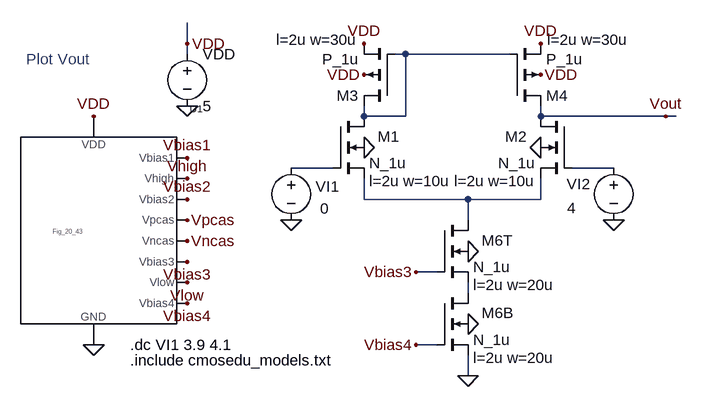
[diagram p0: schematic Fig22_7.asc]
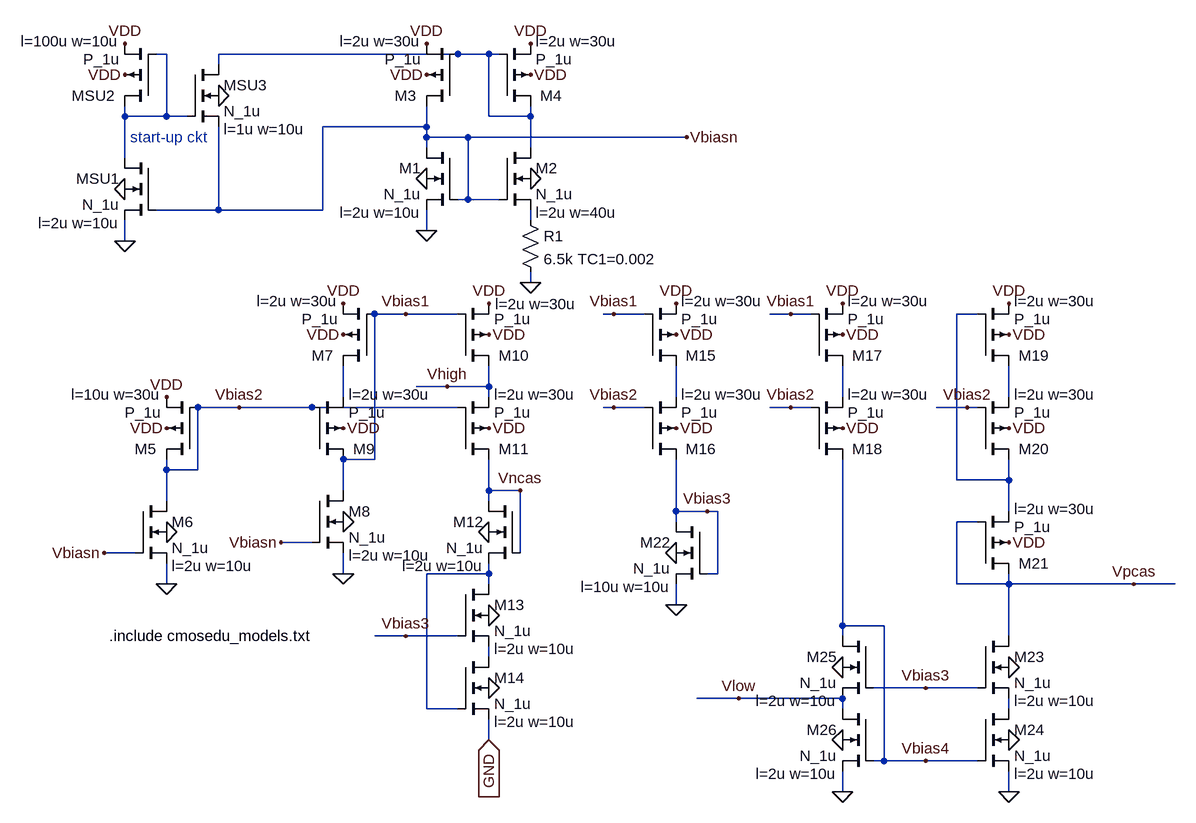
[diagram p1: sub-circuit fig_20_43.asc]
Fig22_7.asc, the LTspice schematic file:
Version 4
SHEET 1 1784 680
WIRE 944 -352 944 -384
WIRE 944 -336 944 -352
WIRE 1280 -336 1264 -336
WIRE 1440 -336 1280 -336
WIRE 1216 -240 1216 -256
WIRE 1280 -240 1280 -336
WIRE 1280 -240 1216 -240
WIRE 1488 -240 1488 -256
WIRE 1680 -240 1488 -240
WIRE 1696 -240 1680 -240
WIRE 1168 -160 1104 -160
WIRE 1600 -160 1536 -160
WIRE 1216 -112 1216 -144
WIRE 1376 -112 1216 -112
WIRE 1488 -112 1488 -144
WIRE 1488 -112 1376 -112
WIRE 1376 -80 1376 -112
WIRE 1328 0 1296 0
WIRE 1376 32 1376 16
WIRE 1328 112 1296 112
WIRE 1376 160 1376 128
FLAG 944 -256 0
FLAG 944 -352 VDD
FLAG 1376 80 0
FLAG 1376 160 0
FLAG 800 -240 VDD
FLAG 800 112 0
FLAG 944 -176 Vbias1
FLAG 944 -144 Vhigh
FLAG 944 -112 Vbias2
FLAG 944 -16 Vbias3
FLAG 944 -80 Vpcas
FLAG 944 -48 Vncas
FLAG 944 48 Vbias4
FLAG 944 16 Vlow
FLAG 1376 -32 0
FLAG 1296 112 Vbias4
FLAG 1296 0 Vbias3
FLAG 1216 -192 0
FLAG 1488 -192 0
FLAG 1104 -80 0
FLAG 1600 -80 0
FLAG 1488 -352 VDD
FLAG 1488 -304 VDD
FLAG 1216 -352 VDD
FLAG 1216 -304 VDD
FLAG 1680 -240 Vout
SYMBOL voltage 944 -352 R0
WINDOW 123 0 0 Left 2
WINDOW 39 0 0 Left 2
SYMATTR InstName VDD
SYMATTR Value 5
SYMBOL nmos4 1328 32 R0
WINDOW 123 56 100 Left 2
WINDOW 0 69 31 Left 2
SYMATTR Value2 l=2u w=20u
SYMATTR InstName M6B
SYMATTR Value N_1u
SYMBOL Fig_20_43 800 -64 R0
SYMATTR InstName U1
SYMBOL nmos4 1328 -80 R0
WINDOW 123 56 100 Left 2
WINDOW 0 69 31 Left 2
SYMATTR Value2 l=2u w=20u
SYMATTR InstName M6T
SYMATTR Value N_1u
SYMBOL nmos4 1168 -240 R0
WINDOW 123 56 100 Left 2
WINDOW 0 69 31 Left 2
SYMATTR Value2 l=2u w=10u
SYMATTR InstName M1
SYMATTR Value N_1u
SYMBOL nmos4 1536 -240 M0
WINDOW 123 56 100 Left 2
WINDOW 0 69 31 Left 2
SYMATTR Value2 l=2u w=10u
SYMATTR InstName M2
SYMATTR Value N_1u
SYMBOL voltage 1600 -176 R0
WINDOW 0 -72 40 Left 2
WINDOW 3 -71 77 Left 2
SYMATTR InstName VI2
SYMATTR Value 4
SYMBOL voltage 1104 -176 R0
WINDOW 0 38 44 Left 2
WINDOW 3 45 78 Left 2
SYMATTR InstName VI1
SYMATTR Value 0
SYMBOL pmos4 1440 -256 M180
WINDOW 123 58 102 Left 2
WINDOW 0 56 16 Left 2
SYMATTR Value2 l=2u w=30u
SYMATTR InstName M4
SYMATTR Value P_1u
SYMBOL pmos4 1264 -256 R180
WINDOW 123 58 102 Left 2
WINDOW 0 56 16 Left 2
SYMATTR Value2 l=2u w=30u
SYMATTR InstName M3
SYMATTR Value P_1u
TEXT 856 136 Left 2 !.include cmosedu_models.txt
TEXT 696 -328 Left 2 ;Plot Vout
TEXT 856 112 Left 2 !.dc VI1 3.9 4.1

fig_20_43.asc, the sub-circuit schematic file:
Version 4
SHEET 1 2164 1112
WIRE 608 -80 592 -80
WIRE 1056 -80 688 -80
WIRE 1104 -80 1056 -80
WIRE 1120 -80 1104 -80
WIRE 688 -64 688 -80
WIRE 544 16 544 0
WIRE 608 16 608 -80
WIRE 608 16 544 16
WIRE 640 16 608 16
WIRE 1104 16 1104 -80
WIRE 1168 16 1168 0
WIRE 1168 16 1104 16
WIRE 1008 32 1008 0
WIRE 1008 32 848 32
WIRE 1008 48 1008 32
WIRE 1072 48 1008 48
WIRE 1408 48 1072 48
WIRE 1008 64 1008 48
WIRE 1168 64 1168 16
WIRE 544 80 544 16
WIRE 1072 144 1072 48
WIRE 1072 144 1056 144
WIRE 1120 144 1072 144
WIRE 688 160 688 32
WIRE 688 160 592 160
WIRE 848 160 848 32
WIRE 848 160 688 160
WIRE 1168 176 1168 160
WIRE 1008 192 1008 160
WIRE 544 208 544 176
WIRE 1168 272 1168 256
WIRE 976 320 928 320
WIRE 1056 320 976 320
WIRE 1296 320 1280 320
WIRE 1344 320 1296 320
WIRE 1568 320 1536 320
WIRE 1600 320 1568 320
WIRE 1856 320 1824 320
WIRE 1040 432 992 432
WIRE 1104 432 1104 400
WIRE 1104 432 1040 432
WIRE 880 448 880 400
WIRE 1104 448 1104 432
WIRE 1392 448 1392 400
WIRE 1648 448 1648 400
WIRE 1904 448 1904 400
WIRE 720 464 656 464
WIRE 832 464 720 464
WIRE 1056 464 832 464
WIRE 1296 464 1280 464
WIRE 1344 464 1296 464
WIRE 1568 464 1536 464
WIRE 1600 464 1568 464
WIRE 1840 464 1792 464
WIRE 1856 464 1840 464
WIRE 928 544 928 320
WIRE 928 544 880 544
WIRE 608 560 608 544
WIRE 656 560 656 464
WIRE 656 560 608 560
WIRE 1824 576 1824 320
WIRE 1904 576 1904 544
WIRE 1904 576 1824 576
WIRE 880 592 880 544
WIRE 1104 592 1104 544
WIRE 1152 592 1104 592
WIRE 608 608 608 560
WIRE 1104 608 1104 592
WIRE 1392 624 1392 544
WIRE 1440 624 1392 624
WIRE 1456 624 1440 624
WIRE 1904 624 1904 576
WIRE 1392 640 1392 624
WIRE 1856 640 1824 640
WIRE 832 672 784 672
WIRE 560 688 512 688
WIRE 1152 688 1152 592
WIRE 880 720 880 688
WIRE 1104 720 1104 704
WIRE 1104 720 1008 720
WIRE 1456 720 1456 624
WIRE 1456 720 1440 720
WIRE 608 736 608 704
WIRE 1104 736 1104 720
WIRE 1824 736 1824 640
WIRE 1904 736 1904 720
WIRE 1904 736 1824 736
WIRE 2096 736 1904 736
WIRE 2160 736 2096 736
WIRE 1392 768 1392 736
WIRE 1648 800 1648 544
WIRE 1712 800 1648 800
WIRE 976 816 928 816
WIRE 1056 816 976 816
WIRE 1648 816 1648 800
WIRE 1904 816 1904 736
WIRE 1104 848 1104 832
WIRE 1776 896 1696 896
WIRE 1856 896 1776 896
WIRE 1488 912 1424 912
WIRE 1648 912 1648 896
WIRE 1648 912 1488 912
WIRE 1008 928 1008 720
WIRE 1056 928 1008 928
WIRE 1648 928 1648 912
WIRE 1904 928 1904 912
WIRE 1104 976 1104 944
WIRE 1712 1008 1712 800
WIRE 1712 1008 1696 1008
WIRE 1776 1008 1712 1008
WIRE 1856 1008 1776 1008
WIRE 1648 1056 1648 1024
WIRE 1904 1056 1904 1024
FLAG 544 -48 VDD
FLAG 544 -96 VDD
FLAG 544 208 0
FLAG 544 128 0
FLAG 688 -16 0
FLAG 1008 -48 VDD
FLAG 1008 -96 VDD
FLAG 1168 -48 VDD
FLAG 1168 -96 VDD
FLAG 1008 192 0
FLAG 1008 112 0
FLAG 1168 272 0
FLAG 1168 112 0
FLAG 1408 48 Vbiasn
FLAG 608 496 VDD
FLAG 608 448 VDD
FLAG 608 736 0
FLAG 608 656 0
FLAG 512 688 Vbiasn
FLAG 880 352 VDD
FLAG 880 304 VDD
FLAG 880 720 0
FLAG 880 640 0
FLAG 784 672 Vbiasn
FLAG 880 496 VDD
FLAG 1104 352 VDD
FLAG 1104 304 VDD
FLAG 1104 496 VDD
FLAG 976 320 Vbias1
FLAG 1040 432 Vhigh
FLAG 720 464 Vbias2
FLAG 1104 656 0
FLAG 1152 592 Vncas
FLAG 1104 784 0
FLAG 1104 896 0
FLAG 976 816 Vbias3
FLAG 1392 352 VDD
FLAG 1392 304 VDD
FLAG 1392 496 VDD
FLAG 1296 320 Vbias1
FLAG 1296 464 Vbias2
FLAG 1648 352 VDD
FLAG 1648 304 VDD
FLAG 1648 496 VDD
FLAG 1568 320 Vbias1
FLAG 1568 464 Vbias2
FLAG 1904 352 VDD
FLAG 1904 304 VDD
FLAG 1904 496 VDD
FLAG 1840 464 Vbias2
FLAG 1904 672 VDD
FLAG 2096 736 Vpcas
FLAG 1392 768 0
FLAG 1392 688 0
FLAG 1440 624 Vbias3
FLAG 1904 864 0
FLAG 1904 976 0
FLAG 1904 1056 0
FLAG 1648 864 0
FLAG 1648 976 0
FLAG 1648 1056 0
FLAG 1776 896 Vbias3
FLAG 1488 912 Vlow
FLAG 1776 1008 Vbias4
FLAG 1104 976 GND
IOPIN 1104 976 In
SYMBOL pmos4 592 0 R180
WINDOW 0 63 16 Left 2
WINDOW 123 56 100 Left 2
SYMATTR InstName MSU2
SYMATTR Value2 l=100u w=10u
SYMATTR Value P_1u
SYMBOL nmos4 592 80 M0
WINDOW 123 56 100 Left 2
SYMATTR Value2 l=2u w=10u
SYMATTR InstName MSU1
SYMATTR Value N_1u
SYMBOL nmos4 640 -64 R0
WINDOW 123 56 100 Left 2
SYMATTR Value2 l=1u w=10u
SYMATTR InstName MSU3
SYMATTR Value N_1u
SYMBOL pmos4 1056 0 R180
WINDOW 0 63 16 Left 2
WINDOW 123 56 100 Left 2
SYMATTR InstName M3
SYMATTR Value2 l=2u w=30u
SYMATTR Value P_1u
SYMBOL pmos4 1120 0 M180
WINDOW 0 63 16 Left 2
WINDOW 123 56 100 Left 2
SYMATTR InstName M4
SYMATTR Value2 l=2u w=30u
SYMATTR Value P_1u
SYMBOL nmos4 1056 64 M0
WINDOW 123 56 100 Left 2
SYMATTR Value2 l=2u w=10u
SYMATTR InstName M1
SYMATTR Value N_1u
SYMBOL nmos4 1120 64 R0
WINDOW 123 56 100 Left 2
SYMATTR Value2 l=2u w=40u
SYMATTR InstName M2
SYMATTR Value N_1u
SYMBOL res 1152 160 R0
SYMATTR InstName R1
SYMATTR Value 6.5k TC1=0.002
SYMBOL pmos4 656 544 R180
WINDOW 0 63 16 Left 2
WINDOW 123 56 100 Left 2
SYMATTR InstName M5
SYMATTR Value2 l=10u w=30u
SYMATTR Value P_1u
SYMBOL nmos4 560 608 R0
WINDOW 123 56 100 Left 2
SYMATTR Value2 l=2u w=10u
SYMATTR InstName M6
SYMATTR Value N_1u
SYMBOL pmos4 928 400 R180
WINDOW 0 63 16 Left 2
WINDOW 123 56 100 Left 2
SYMATTR InstName M7
SYMATTR Value2 l=2u w=30u
SYMATTR Value P_1u
SYMBOL nmos4 832 592 R0
WINDOW 123 56 100 Left 2
SYMATTR Value2 l=2u w=10u
SYMATTR InstName M8
SYMATTR Value N_1u
SYMBOL pmos4 832 544 M180
WINDOW 0 63 16 Left 2
WINDOW 123 56 100 Left 2
SYMATTR InstName M9
SYMATTR Value2 l=2u w=30u
SYMATTR Value P_1u
SYMBOL pmos4 1056 400 M180
WINDOW 0 63 16 Left 2
WINDOW 123 58 95 Left 2
SYMATTR InstName M10
SYMATTR Value2 l=2u w=30u
SYMATTR Value P_1u
SYMBOL pmos4 1056 544 M180
WINDOW 0 63 16 Left 2
WINDOW 123 56 100 Left 2
SYMATTR InstName M11
SYMATTR Value2 l=2u w=30u
SYMATTR Value P_1u
SYMBOL nmos4 1152 608 M0
WINDOW 123 56 100 Left 2
SYMATTR Value2 l=2u w=10u
SYMATTR InstName M12
SYMATTR Value N_1u
SYMBOL nmos4 1056 736 R0
WINDOW 123 56 100 Left 2
SYMATTR Value2 l=2u w=10u
SYMATTR InstName M13
SYMATTR Value N_1u
SYMBOL nmos4 1056 848 R0
WINDOW 123 56 100 Left 2
SYMATTR Value2 l=2u w=10u
SYMATTR InstName M14
SYMATTR Value N_1u
SYMBOL pmos4 1344 400 M180
WINDOW 0 63 16 Left 2
WINDOW 123 56 100 Left 2
SYMATTR InstName M15
SYMATTR Value2 l=2u w=30u
SYMATTR Value P_1u
SYMBOL pmos4 1344 544 M180
WINDOW 0 63 16 Left 2
WINDOW 123 56 100 Left 2
SYMATTR InstName M16
SYMATTR Value2 l=2u w=30u
SYMATTR Value P_1u
SYMBOL pmos4 1600 400 M180
WINDOW 0 63 16 Left 2
WINDOW 123 56 100 Left 2
SYMATTR InstName M17
SYMATTR Value2 l=2u w=30u
SYMATTR Value P_1u
SYMBOL pmos4 1600 544 M180
WINDOW 0 63 16 Left 2
WINDOW 123 56 100 Left 2
SYMATTR InstName M18
SYMATTR Value2 l=2u w=30u
SYMATTR Value P_1u
SYMBOL pmos4 1856 400 M180
WINDOW 0 63 16 Left 2
WINDOW 123 56 100 Left 2
SYMATTR InstName M19
SYMATTR Value2 l=2u w=30u
SYMATTR Value P_1u
SYMBOL pmos4 1856 544 M180
WINDOW 0 63 16 Left 2
WINDOW 123 56 100 Left 2
SYMATTR InstName M20
SYMATTR Value2 l=2u w=30u
SYMATTR Value P_1u
SYMBOL pmos4 1856 720 M180
WINDOW 0 63 16 Left 2
WINDOW 123 56 100 Left 2
SYMATTR InstName M21
SYMATTR Value2 l=2u w=30u
SYMATTR Value P_1u
SYMBOL nmos4 1440 640 M0
WINDOW 123 56 100 Left 2
SYMATTR Value2 l=10u w=10u
SYMATTR InstName M22
SYMATTR Value N_1u
SYMBOL nmos4 1856 816 R0
WINDOW 123 56 100 Left 2
SYMATTR Value2 l=2u w=10u
SYMATTR InstName M23
SYMATTR Value N_1u
SYMBOL nmos4 1856 928 R0
WINDOW 123 56 100 Left 2
SYMATTR Value2 l=2u w=10u
SYMATTR InstName M24
SYMATTR Value N_1u
SYMBOL nmos4 1696 816 M0
WINDOW 123 56 100 Left 2
SYMATTR Value2 l=2u w=10u
SYMATTR InstName M25
SYMATTR Value N_1u
SYMBOL nmos4 1696 928 M0
WINDOW 123 56 100 Left 2
SYMATTR Value2 l=2u w=10u
SYMATTR InstName M26
SYMATTR Value N_1u
TEXT 552 48 Left 2 ;start-up ckt
TEXT 520 816 Left 2 !.include cmosedu_models.txt

The netlist it stands for:
* Fig22_7.asc
VDD VDD 0 5
M6B N005 Vbias4 0 0 N_1u l=2u w=20u
XU1 Vbias1 Vhigh Vbias2 Vpcas Vncas Vbias3 Vlow Vbias4 VDD 0 fig_20_43
M6T N004 Vbias3 N005 0 N_1u l=2u w=20u
M1 N001 N002 N004 0 N_1u l=2u w=10u
M2 Vout N003 N004 0 N_1u l=2u w=10u
VI2 N003 0 4
VI1 N002 0 0
M4 Vout N001 VDD VDD P_1u l=2u w=30u
M3 N001 N001 VDD VDD P_1u l=2u w=30u

* block symbol definitions
.subckt fig_20_43 Vbias1 Vhigh Vbias2 Vpcas Vncas Vbias3 Vlow Vbias4 VDD GND
MSU2 N001 N001 VDD VDD P_1u l=100u w=10u
MSU1 N001 Vbiasn 0 0 N_1u l=2u w=10u
MSU3 N002 N001 Vbiasn 0 N_1u l=1u w=10u
M3 Vbiasn N002 VDD VDD P_1u l=2u w=30u
M4 N002 N002 VDD VDD P_1u l=2u w=30u
M1 Vbiasn Vbiasn 0 0 N_1u l=2u w=10u
M2 N002 Vbiasn N003 0 N_1u l=2u w=40u
R1 N003 0 6.5k TC1=0.002
M5 Vbias2 Vbias2 VDD VDD P_1u l=10u w=30u
M6 Vbias2 Vbiasn 0 0 N_1u l=2u w=10u
M7 N005 Vbias1 VDD VDD P_1u l=2u w=30u
M8 Vbias1 Vbiasn 0 0 N_1u l=2u w=10u
M9 Vbias1 Vbias2 N005 VDD P_1u l=2u w=30u
M10 Vhigh Vbias1 VDD VDD P_1u l=2u w=30u
M11 Vncas Vbias2 Vhigh VDD P_1u l=2u w=30u
M12 Vncas Vncas N009 0 N_1u l=2u w=10u
M13 N009 Vbias3 N010 0 N_1u l=2u w=10u
M14 N010 N009 GND 0 N_1u l=2u w=10u
M15 N006 Vbias1 VDD VDD P_1u l=2u w=30u
M16 Vbias3 Vbias2 N006 VDD P_1u l=2u w=30u
M17 N007 Vbias1 VDD VDD P_1u l=2u w=30u
M18 Vbias4 Vbias2 N007 VDD P_1u l=2u w=30u
M19 N008 N004 VDD VDD P_1u l=2u w=30u
M20 N004 Vbias2 N008 VDD P_1u l=2u w=30u
M21 Vpcas Vpcas N004 VDD P_1u l=2u w=30u
M22 Vbias3 Vbias3 0 0 N_1u l=10u w=10u
M23 Vpcas Vbias3 N011 0 N_1u l=2u w=10u
M24 N011 Vbias4 0 0 N_1u l=2u w=10u
M25 Vbias4 Vbias3 Vlow 0 N_1u l=2u w=10u
M26 Vlow Vbias4 0 0 N_1u l=2u w=10u
* start-up ckt
.include cmosedu_models.txt
.ends fig_20_43

.model NMOS NMOS
.model PMOS PMOS
.lib standard.mos
.include cmosedu_models.txt
* Plot Vout
.dc VI1 3.9 4.1
.backanno
.end